# EAGLE design MainBoard (EAGLE 9.2.2)
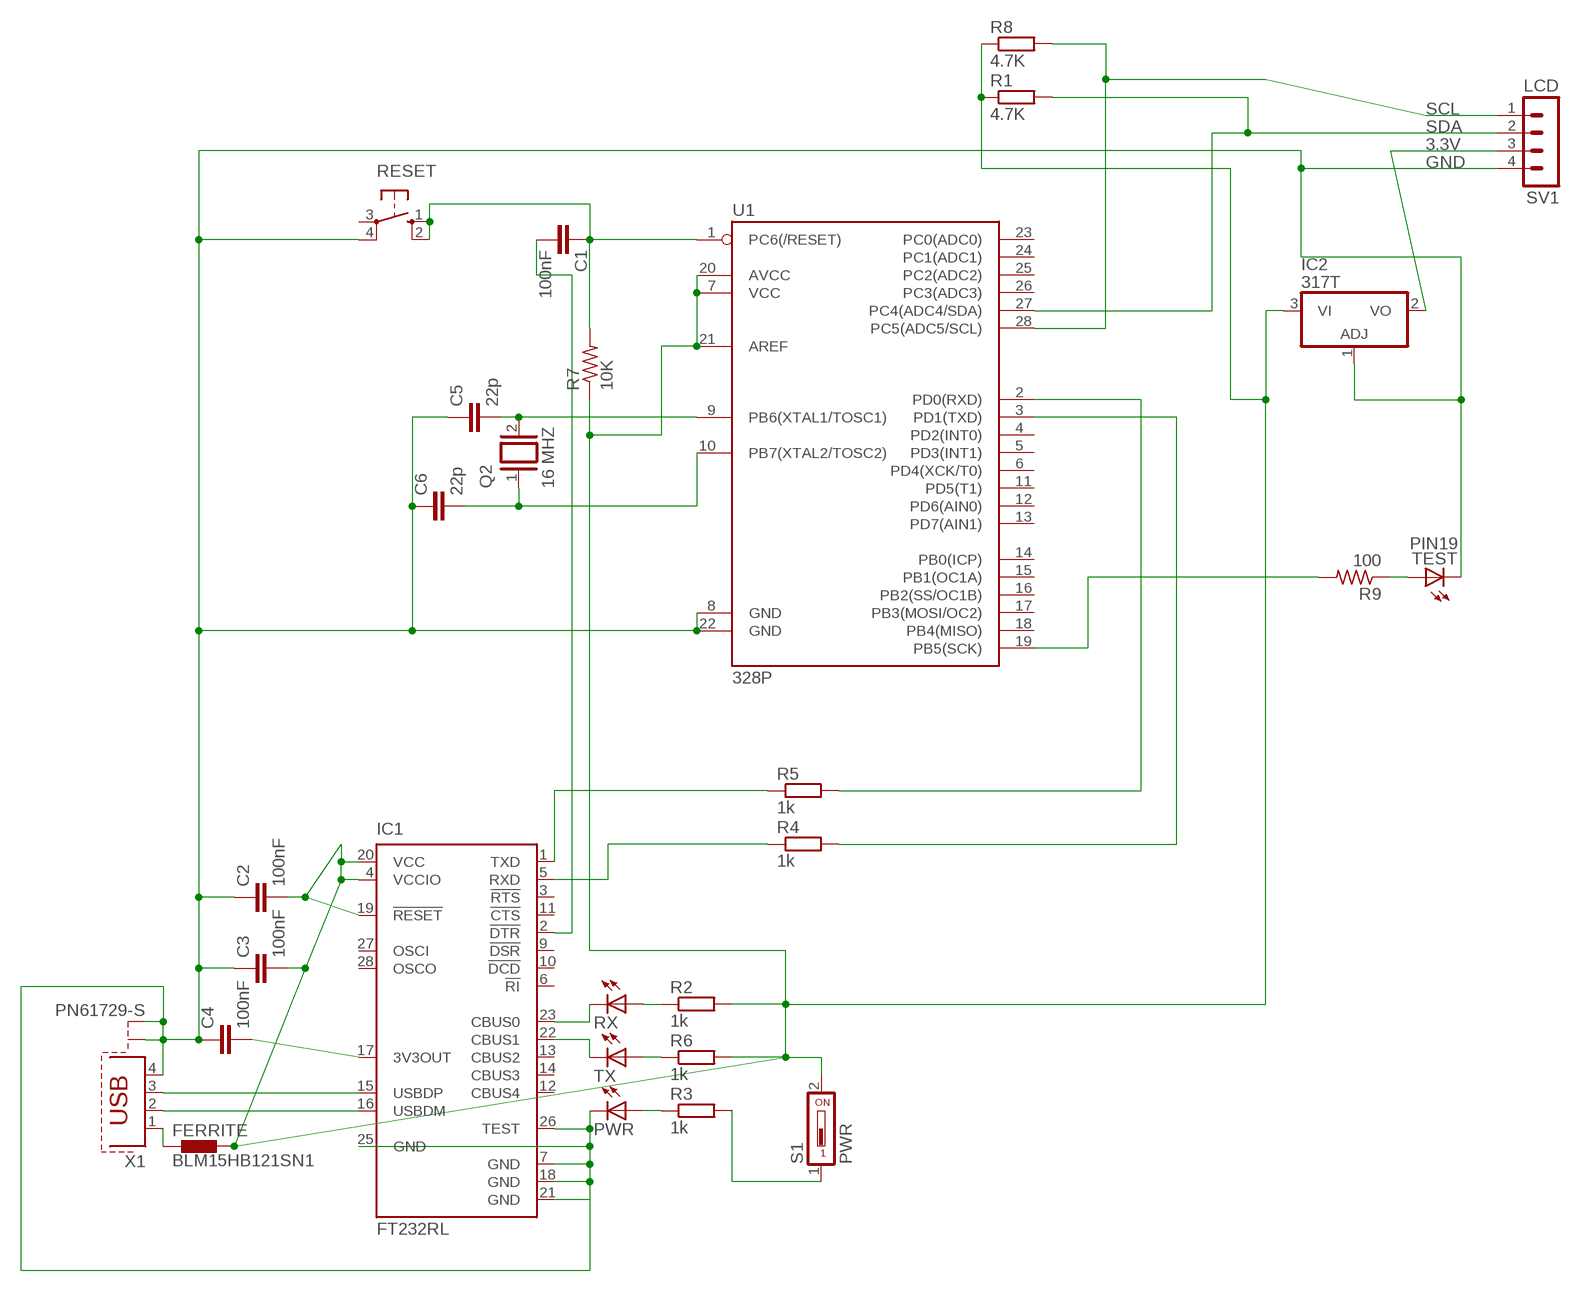
[diagram p0: schematic, sheet 1]

## Parts
C1  100nF  C-EU025-025X050  [C025-025X050]
C2  100nF  C-EU025-025X050  [C025-025X050]
C3  100nF  C-EU025-025X050  [C025-025X050]
C4  100nF  C-EU025-025X050  [C025-025X050]
C5  22p  C-EU025-025X050  [C025-025X050]
C6  22p  C-EU025-025X050  [C025-025X050]
FERRITE  BLM15HB121SN1  [0402]
IC1  FT232RL  [SSOP28]
IC2  317T  [TO220H]
PWR  LED5MM  [LED5MM]
Q2  16 MHZ  XTAL/S  [QS]
R1  4.7K  R-EU_0207/10  [0207/10]
R2  1k  R-EU_0207/10  [0207/10]
R3  1k  R-EU_0207/10  [0207/10]
R4  1k  R-EU_0207/10  [0207/10]
R5  1k  R-EU_0207/10  [0207/10]
R6  1k  R-EU_0207/10  [0207/10]
R7  10K  R-US_0207/10  [0207/10]
R8  4.7K  R-EU_0207/10  [0207/10]
R9  100  R-US_0207/10  [0207/10]
RESET  10-XX  [B3F-10XX]
RX  LED5MM  [LED5MM]
S1  PWR  DS01  [DS-01]
SV1  LCD  MA04-1  [MA04-1]
TEST  PIN19  LED5MM  [LED5MM]
TX  LED5MM  [LED5MM]
U1  328P  ATMEGA328P_PDIP  [DIP28]
X1  PN61729-S  [PN61729-S]

## Nets
3.3V: IC2.2(VO) SV1.3
GND: C2.1 C3.1 C4.1 C5.1 C6.1 IC1.7(GND) IC1.18(GND) IC1.21(GND) IC1.25(GND) IC1.26(TEST) IC2.1(ADJ) PWR.K(C) RESET.4(P1) SV1.4 TEST.K(C) U1.8(GND) U1.22(GND) X1.4 X1.S1 X1.S2
N$1: IC1.1(TXD) R5.1
N$2: IC1.16(USBDM) X1.2
N$3: IC1.15(USBDP) X1.3
N$4: C2.2 C3.2 FERRITE.2 IC1.4(VCCIO) IC1.19(!RESET) IC1.20(VCC) IC2.3(VI) R1.1 R2.2 R6.2 R7.1 R8.1 S1.2 U1.7(VCC) U1.20(AVCC) U1.21(AREF)
N$5: C4.2 IC1.17(3V3OUT)
N$6: FERRITE.1 X1.1
N$7: R9.1 TEST.A
N$8: IC1.5(RXD) R4.1
N$9: R5.2 U1.2(PD0(RXD))
N$10: R4.2 U1.3(PD1(TXD))
N$11: IC1.23(CBUS0) RX.K(C)
N$12: R2.1 RX.A
N$13: IC1.22(CBUS1) TX.K(C)
N$14: R6.1 TX.A
N$15: PWR.A R3.1
N$16: R3.2 S1.1
N$17: C1.2 IC1.2(!DTR)
N$21: R9.2 U1.19(PB5(SCK))
N$23: C5.2 Q2.2 U1.9(PB6(XTAL1/TOSC1))
N$24: C6.2 Q2.1 U1.10(PB7(XTAL2/TOSC2))
PIN1: C1.1 R7.2 RESET.1(S) RESET.2(S1) U1.1(PC6(/RESET))
SCL: R8.2 SV1.1 U1.28(PC5(ADC5/SCL))
SDA: R1.2 SV1.2 U1.27(PC4(ADC4/SDA))
Unconnected: IC1.3(!RTS) IC1.6(!RI) IC1.9(!DSR) IC1.10(!DCD) IC1.11(!CTS) IC1.12(CBUS4) IC1.13(CBUS2) IC1.14(CBUS3) IC1.27(OSCI) IC1.28(OSCO) RESET.3(P) U1.4(PD2(INT0)) U1.5(PD3(INT1)) U1.6(PD4(XCK/T0)) U1.11(PD5(T1)) U1.12(PD6(AIN0)) U1.13(PD7(AIN1)) U1.14(PB0(ICP)) U1.15(PB1(OC1A)) U1.16(PB2(SS/OC1B)) U1.17(PB3(MOSI/OC2)) U1.18(PB4(MISO)) U1.23(PC0(ADC0)) U1.24(PC1(ADC1)) U1.25(PC2(ADC2)) U1.26(PC3(ADC3))

## Library data of the parts
C1-C6 = rcl:C-EU: CAPACITOR, European symbol; SPICEPREFIX: C
FERRITE = inductors:BLM15H: EMIFIL (R) Chip Ferrite Bead for GHz Noise Source: http://www.murata.com/ Ferrite Bead BLM15H.pdf
IC1 = ftdichip:FT232R: Source: http://www.ftdichip.com/Documents/DataSheets/DS_FT232R_v104.pdf; MPN: FT232RL; OC_FARNELL: 1146032; OC_NEWARK: 91K9918
IC2 = linear:*317: Positive VOLTAGE REGULATOR
PWR RX TEST TX = led:LED: LED OSRAM: - CHIPLED LG R971, LG N971, LY N971, LG Q971, LY Q971, LO R971, LY R971 LH N974, LH R974 LS Q976, LO Q976, LY Q976 LO Q996 - Hyper CHIPLED LW Q18S LB Q993, LB Q99A, LB R99A - SideLED LS A670, LO A670, LY A670, LG A670, LP A670 LB A673, LV A673, LT A673, LW A673 LH A674 LY A675 LS A676, LA A676, LO A676, LY A676, LW A676 LS A679, LY A679, LG A679 - Hyper Micro SIDELED® LS Y876, LA Y876, LO Y876, LY Y876 LT Y87S - SmartLED LW L88C, LW L88S LB L89C, LB L89S, LG L890 LS L89K, LO L89K, LY L89K LS L896, LA L896, LO L896, LY L896 - TOPLED LS T670, LO T670, LY T670, LG T670, LP T670 LSG T670, LSP T670, LSY T670, LOP T670, LYG T670 LG T671, LOG T671, LSG T671 LB T673, LV T673, LT T673, LW T673 LH T674 LS T676, LA T676, LO T676, LY T676, LB T676, LH T676, LSB T676, LW T676 LB T67C, LV T67C, LT T67C, LS T67K, LO T67K, LY T67K, LW E67C LS E67B, LA E67B, LO E67B, LY E67B, LB E67C, LV E67C, LT E67C LW T67C LS T679, LY T679, LG T679 LS T770, LO T770, LY T770, LG T770, LP T770 LB T773, LV T773, LT T773, LW T773 LH T774 LS E675, LA E675, LY E675, LS T675 LS T776, LA T776, LO T776, LY T776, LB T776 LHGB T686 LT T68C, LB T68C - Hyper Mini TOPLED® LB M676 - Mini TOPLED Santana® LG M470 LS M47K, LO M47K, LY M47K Source: http://www.osram.convergy.de LUXEON: - LUMILED® LXK2-PW12-R00, LXK2-PW12-S00, LXK2-PW14-U00, LXK2-PW14-V00 LXK2-PM12-R00, LXK2-PM12-S00, LXK2-PM14-U00 LXK2-PE12-Q00, LXK2-PE12-R00, LXK2-PE12-S00, LXK2-PE14-T00, LXK2-PE14-U00 LXK2-PB12-K00, LXK2-PB12-L00, LXK2-PB12-M00, LXK2-PB14-N00, LXK2-PB14-P00, LXK2-PB14-Q00 LXK2-PR12-L00, LXK2-PR12-M00, LXK2-PR14-Q00, LXK2-PR14-R00 LXK2-PD12-Q00, LXK2-PD12-R00, LXK2-PD12-S00 LXK2-PH12-R00, LXK2-PH12-S00 LXK2-PL12-P00, LXK2-PL12-Q00, LXK2-PL12-R00 Source: www.luxeon.com KINGBRIGHT: KA-3528ASYC Source: www.kingbright.com
Q2 = special:XTAL/S: CRYSTAL
R1-R6 R8 = resistor:R-EU_: RESISTOR, European symbol
R7 R9 = resistor:R-US_: RESISTOR, American symbol
RESET = switch-omron:10-XX: OMRON SWITCH; MPN: B3F-1000; OC_FARNELL: 176432; OC_NEWARK: 36M3542
S1 = switch-dil:DS01: DIL/CODE SWITCH; OC_FARNELL: unknown; OC_NEWARK: unknown
SV1 = con-lstb:MA04-1: PIN HEADER; OC_FARNELL: unknown; OC_NEWARK: unknown
U1 = SparkFun-IC-Microcontroller:ATMEGA328P_PDIP: Atmel 328P Through hole ATMEGA328P uC used in the Arduino 32kb flash, 1k EEPROM, 2k SRAM Datasheet <http://www.sparkfun.com/datasheets/Components/SMD/ATMega328.pdf> SparkFun Products Storefront component: AVR 28 Pin 20MHz 32K 6A/D - ATMega328P <https://www.sparkfun.com/products/9061> (COM-09061) SparkFun Simon Says - Through-Hole Soldering Kit <https://www.sparkfun.com/products/10547> (KIT-10547) SparkFun Learn to Solder - Simon Says <https://www.sparkfun.com/products/13708> (KIT-13708) SparkFun BigTime Watch Kit <https://www.sparkfun.com/products/11734> (KIT-11734) SparkFun ClockIt <https://www.sparkfun.com/products/10930> (KIT-10930) SparkFun Serial Enabled LCD Kit <https://www.sparkfun.com/products/10097> (LCD-10097) SparkFun Simon Tilts - Through Hole Soldering Kit <https://www.sparkfun.com/products/12634> (KIT-12634) SparkFun Frequency Counter Kit <https://www.sparkfun.com/products/10140> (KIT-10140) FabFM Radio Kit <https://www.sparkfun.com/products/11043> (KIT-11043) SparkFun Binary Blaster Kit <https://www.sparkfun.com/products/12037> (KIT-12037) SparkFun Metro-Gnome <https://www.sparkfun.com/products/9236> (KIT-09236) ATmega328 with Arduino Optiboot (Uno) <https://www.sparkfun.com/products/10524> (DEV-10524); PROD_ID: IC-09136
X1 = con-berg:PN61729-S: BERG USB connector; OC_FARNELL: unknown; OC_NEWARK: unknown

## Net classes
0 default: width 0.254 mm, drill 0.33 mm, clearance 0.251 mm

## Board
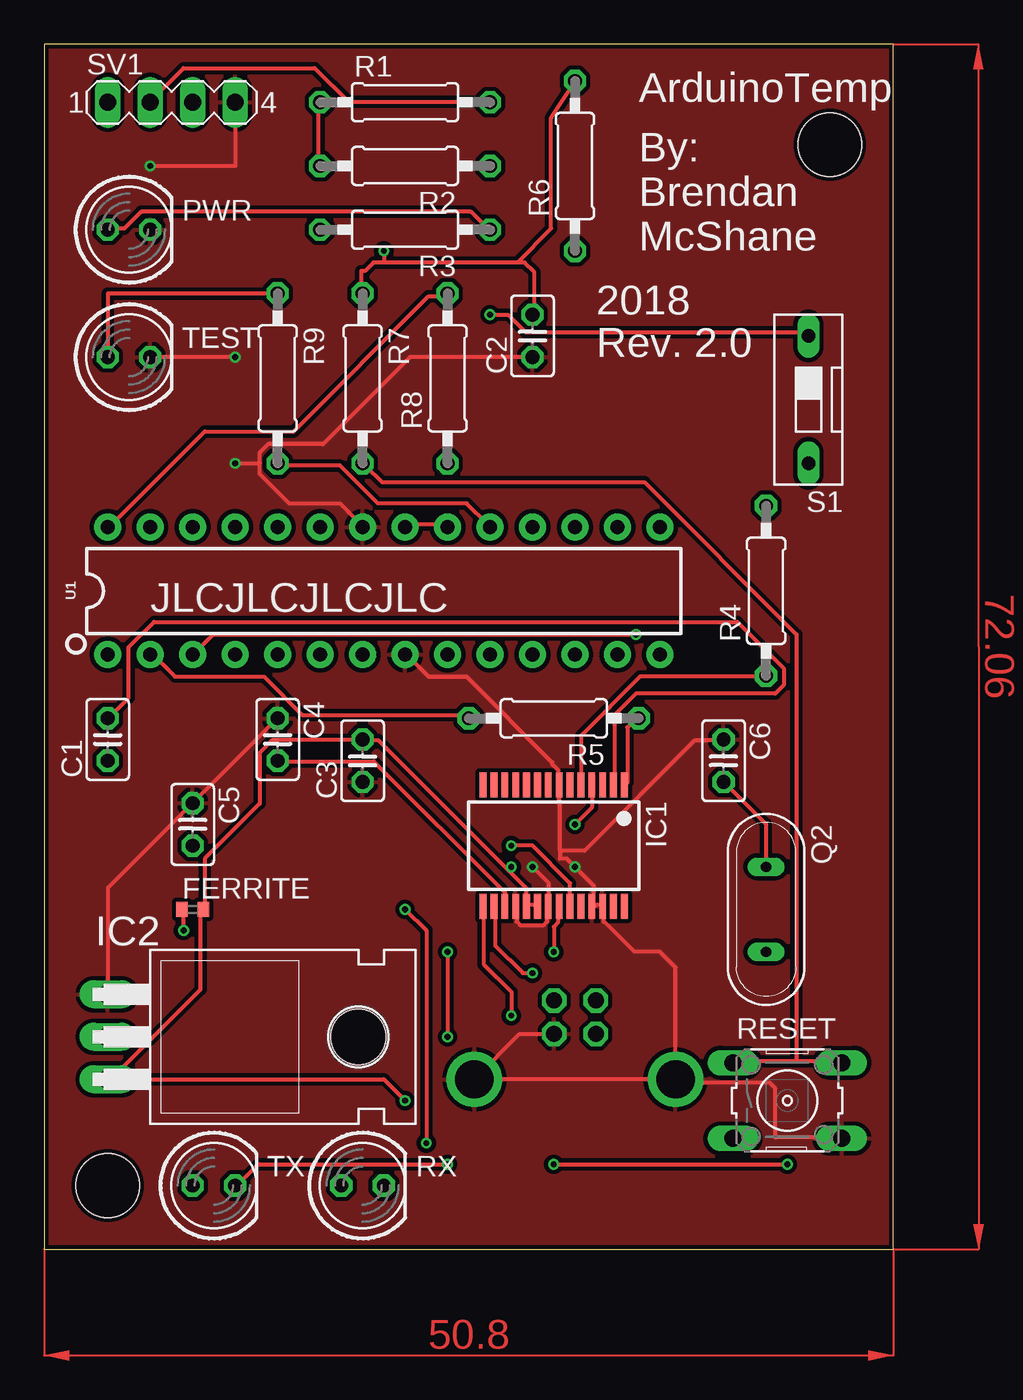
[diagram p1: board, top side]
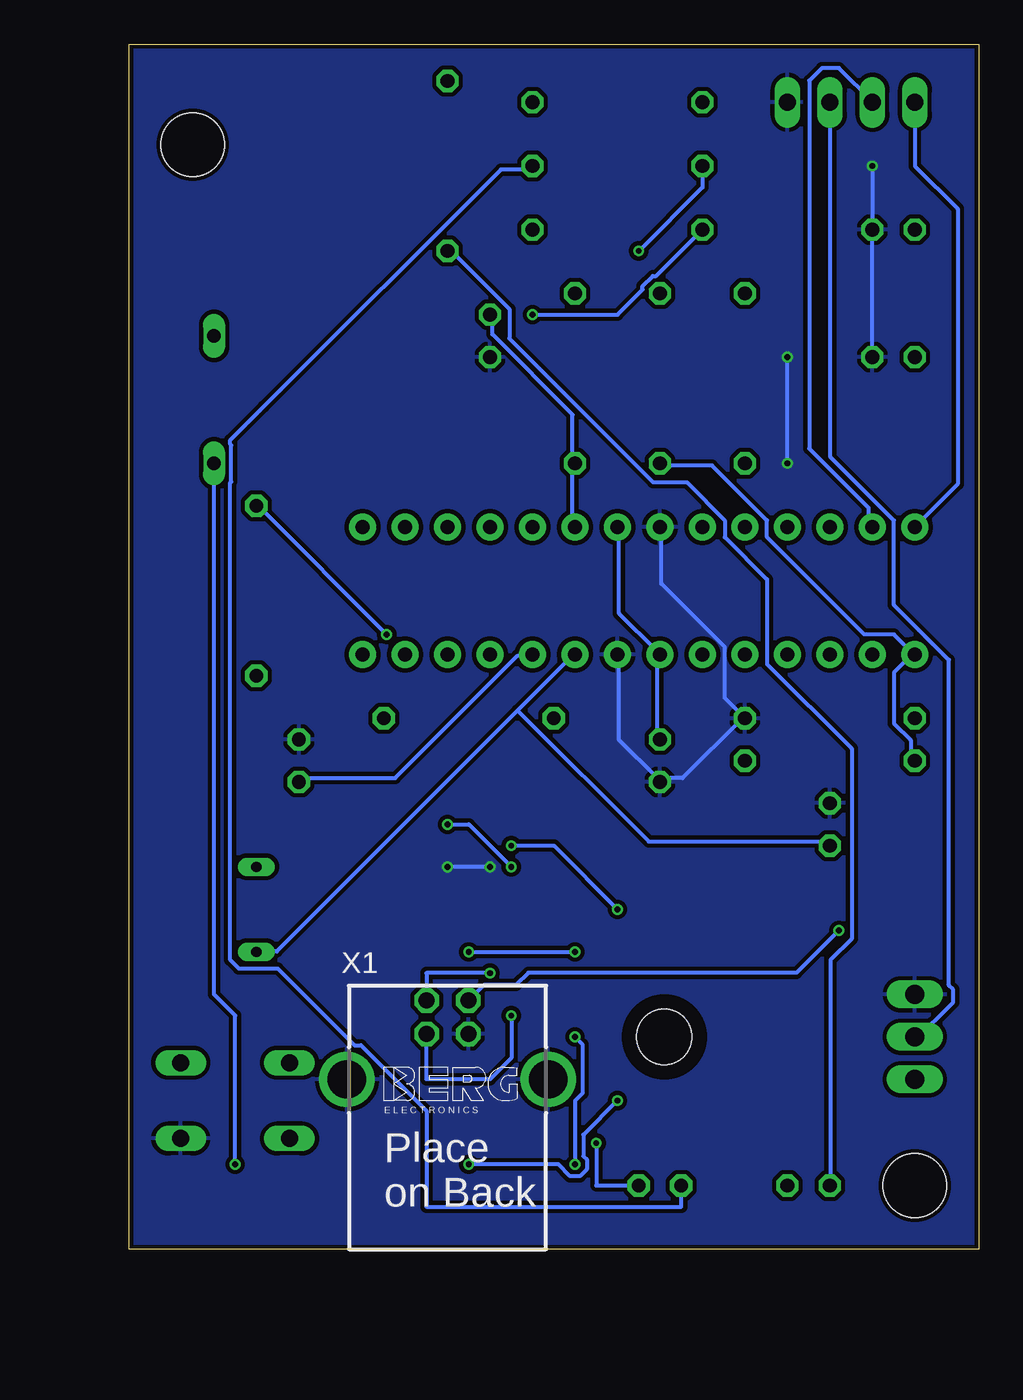
[diagram p2: board, bottom side, seen from below]

Size 50.78 x 72.06 mm. Coordinates in mm from the lower left corner, seen from the top.
Outline: 0,0 50.78,0 50.78,72.06 0,72.06 0,0
Copper layers (1*16): Top 0.035mm / dielectric 1.5mm / Bottom 0.035mm
Design rules "dirt_cheap_dirty_boards.v1.1": minimum track width 6mil, minimum drill 12mil, track to track 6mil, track to pad 6mil, pad to pad 6mil, via to via 6mil, smd to smd 0mil, copper to edge 10mil, drill to drill 10mil, minimum pad ring 10mil, minimum via ring 6mil, stop-mask expansion 2mil, vias tented up to drill 25mil, thermal gap 10mil
Holes 3.81 mm at 46.99,66.04 3.81,3.81

### Footprints (pad centres in the part's own frame; a part is rotated, then mirrored left to right if it is on the bottom)
C025-025X050 = drill 0.813 octagon: 1 -1.27,0; 2 1.27,0
0402 = smd 0.7 x 0.9: 1 -0.65,0; 2 0.65,0
SSOP28 = smd 0.4 x 1.5: 1 -4.225,-3.625; 2 -3.575,-3.625; 3 -2.925,-3.625; 4 -2.275,-3.625; 5 -1.625,-3.625; 6 -0.975,-3.625; 7 -0.325,-3.625; 8 0.325,-3.625; 9 0.975,-3.625; 10 1.625,-3.625; 11 2.275,-3.625; 12 2.925,-3.625; 13 3.575,-3.625; 14 4.225,-3.625; 15 4.225,3.625; 16 3.575,3.625; 17 2.925,3.625; 18 2.275,3.625; 19 1.625,3.625; 20 0.975,3.625; 21 0.325,3.625; 22 -0.325,3.625; 23 -0.975,3.625; 24 -1.625,3.625; 25 -2.275,3.625; 26 -2.925,3.625; 27 -3.575,3.625; 28 -4.225,3.625
TO220H = drill 1.118 long: 1 -2.54,-10.16; 2 0,-10.16; 3 2.54,-10.16 | hole 3.302: 0,4.826
LED5MM = drill 0.813 octagon: A -1.27,0; K 1.27,0
QS = drill 0.61 long: 1 -2.54,0; 2 2.54,0
0207/10 = drill 0.813 octagon: 1 -5.08,0; 2 5.08,0
B3F-10XX = drill 1.016 long: 1 -3.251,2.261; 2 3.251,2.261; 3 -3.251,-2.261; 4 3.251,-2.261
DS-01 = drill 0.813 long: 1 0,-3.81; 2 0,3.81
MA04-1 = drill 1.016 long: 1 -3.81,0; 2 -1.27,0; 3 1.27,0; 4 3.81,0
DIP28 = drill 0.813 pad 1.626: 1 -16.51,-3.81; 2 -13.97,-3.81; 3 -11.43,-3.81; 4 -8.89,-3.81; 5 -6.35,-3.81; 6 -3.81,-3.81; 7 -1.27,-3.81; 8 1.27,-3.81; 9 3.81,-3.81; 10 6.35,-3.81; 11 8.89,-3.81; 12 11.43,-3.81; 13 13.97,-3.81; 14 16.51,-3.81; 15 16.51,3.81; 16 13.97,3.81; 17 11.43,3.81; 18 8.89,3.81; 19 6.35,3.81; 20 3.81,3.81; 21 1.27,3.81; 22 -1.27,3.81; 23 -3.81,3.81; 24 -6.35,3.81; 25 -8.89,3.81; 26 -11.43,3.81; 27 -13.97,3.81; 28 -16.51,3.81
PN61729-S = drill 0.95 octagon: 1 1.25,4.71; 2 -1.25,4.71; 3 -1.25,2.71; 4 1.25,2.71 | drill 2.3 pad 2.9: S1 -6.02,0; S2 6.02,0

### Placement (x,y rotation side)
C1  3.81,30.48 90 top
C2  29.21,54.61 90 top
C3  19.05,29.21 90 top
C4  13.97,30.48 270 top
C5  8.89,25.4 270 top
C6  40.64,29.21 270 top
FERRITE  8.89,20.32 0 top
IC1  30.48,24.13 180 top
IC2  13.97,12.7 270 top
PWR  5.08,60.96 0 top
Q2  43.18,20.32 270 top
R1  21.59,68.58 0 top
R2  21.59,64.77 180 top
R3  21.59,60.96 180 top
R4  43.18,39.37 90 top
R5  30.48,31.75 180 top
R6  31.75,64.77 90 top
R7  19.05,52.07 270 top
R8  24.13,52.07 90 top
R9  13.97,52.07 270 top
RESET  44.45,8.89 0 top
RX  19.05,3.81 0 top
S1  45.72,50.8 180 top
SV1  7.62,68.58 0 top
TEST  5.08,53.34 0 top
TX  10.16,3.81 0 top
U1  20.32,39.37 0 top
X1  31.75,10.16 0 bottom

### Tracks (layer width: path | path; a pad name or v marks a point on that pad's centre or on a via)
3.3V
  Bottom 0.254: SV1.3 8.85,68.35 8.85,47.37 5.06,43.58 5.06,38.53 1.77,35.24 1.77,15.78 1.52,15.53 1.52,14.77 3.8,12.5 IC2.2
GND  (via drill 0.35)
  Top 0.254: 33.02,20.58 33.37,20.58 33.48,20.47 33.48,20.43 | 33.02,20.58 32.86,20.58 32.86,21.75 v31.75,22.86 31.25,23.36 30.84,23.36 30.84,23.86 | 30.84,23.86 30.84,26.67 30.8,26.7 IC1.7 30.73,27.83 30.73,28.66 30.39,29 30.39,29.12 25.28,34.23 23,34.23 21.74,35.5 U1.8 | 30.84,23.86 32.34,23.86 38.93,30.44 40.44,30.44 C6.1 | RESET.4 47.52,6.68 43.73,6.68 43.73,9.61 43.37,9.97 37.96,9.97 X1.S1 | C4.1 13.91,31.7 8.89,26.69 C5.1 3.81,21.59 IC2.1 | 12.89,46.99 12.89,46.36 14.66,44.59 17.7,44.59 18.96,43.33 U1.22 | 12.89,46.99 12.89,47.63 13.4,48.13 16.69,48.13 21.89,53.34 C2.1 | v29.21,22.86 30.16,21.91 IC1.21 30.08,20.43 30.08,19.6 29.86,19.38 28.5,19.38 28.28,19.6 28.28,20.43 IC1.18 | X1.S1 X1.S2 28.44,12.87 X1.4 | X1.S1 37.77,16.84 36.83,17.78 35.3,17.78 33.48,19.6 33.48,20.43 | 12.89,46.99 v11.43,46.99 | v11.43,53.34 TEST.K | SV1.4 11.43,64.77 v6.35,64.77 | IC1.26 33.48,20.43 | 33.02,20.58 32.94,20.5 IC1.25
  Bottom 0.254: U1.22 18.96,43.08 18.96,39.79 15.17,36 15.17,32.97 14.16,31.96 C4.1 14.16,31.7 17.7,28.17 18.96,28.17 C3.1 19.21,28.17 21.49,30.44 21.49,35.5 U1.8 | v29.21,22.86 v31.75,22.86 | v11.43,46.99 v11.43,53.34 | TEST.K PWR.K v6.35,64.77
  pour Top: 0,72.39 50.8,72.39 50.8,0 0,0
  pour Bottom: 0,72.39 50.8,72.39 50.8,0 0,0
N$1
  Top 0.254: IC1.1 34.88,27.91 34.88,31.2 35.39,31.7 R5.1
N$2  (via drill 0.35)
  Top 0.254: IC1.16 26.98,20.43 26.98,18.16 28.63,16.51 v29.21,16.51
  Bottom 0.254: v29.21,16.51 33.02,16.51 33,16.49 X1.2
N$3  (via drill 0.35)
  Top 0.254: IC1.15 26.29,20.33 26.29,17.05 27.94,15.4 v27.94,13.97
  Bottom 0.254: v27.94,13.97 27.94,11.43 29.21,10.16 33.02,10.16 33.02,12.85 X1.3
N$4  (via drill 0.35)
  Top 0.254: R7.1 18.96,57.23 18.96,58.49 19.2,58.49 19.7,59 20.32,59 | R1.1 16.43,68.35 16.43,64.81 R2.2 | 28.31,59 30.33,61.02 30.33,67.64 R6.2 | C2.2 29.32,55.97 29.32,58.42 28.74,59 28.31,59 | U1.21 21.74,43.33 24.02,43.33 U1.20 | 28.31,59 20.32,59 | 28.82,20.58 29.32,20.58 IC1.20 | 28.82,20.58 28.82,21.59 27.75,22.67 | 27.75,22.67 19.97,30.44 19.21,30.44 C3.2 18.96,30.44 13.65,30.44 12.89,29.68 12.89,26.65 9.61,23.36 9.61,20.33 FERRITE.2 9.36,20.08 9.36,15.53 4.05,10.22 IC2.3 20.32,10.16 v21.59,8.89 | 28.82,20.58 IC1.19 | IC1.4 32.76,26.4 v31.75,25.4 | v27.94,22.86 | v27.94,22.86 27.75,22.67 | v30.48,5.08 v44.45,5.08 | v20.32,59.69 20.32,59
  Bottom 0.254: U1.20 24.27,43.33 24.27,46.87 R8.1 24.27,47.12 24.27,49.9 29.07,54.7 29.07,55.71 C2.2 | C3.2 19.21,30.69 19.21,35.5 U1.7 19.21,35.75 21.49,38.02 21.49,43.08 U1.21 | v31.75,25.4 30.48,25.4 v27.94,22.86 | v21.59,8.89 23.62,6.86 23.62,5.57 23.42,5.37 23.42,4.79 23.84,4.37 24.42,4.37 25.13,5.08 v30.48,5.08 | v44.45,5.08 44.45,13.97 45.72,15.24 S1.2 | R2.2 16.51,63.5 v20.32,59.69
N$5
  Top 0.254: IC1.17 27.55,20.58 27.55,21.34 19.72,29.18 14.16,29.18 C4.2
N$6  (via drill 0.35)
  Top 0.254: v8.35,19.07 8.35,20.08 FERRITE.1
  Bottom 0.254: v8.35,19.07 10.89,16.53 26.92,16.53 27.65,15.8 29.57,15.8 X1.1
N$7
  Top 0.254: R9.1 3.81,57.15 TEST.A
N$8
  Top 0.254: IC1.5 32.1,27.91 32.1,30.69 35.64,34.23 42.97,34.23 R4.1
N$9
  Top 0.254: R5.2 25.28,31.96 15.42,31.96 13.15,34.23 7.84,34.23 6.58,35.5 U1.2
N$10  (via drill 0.35)
  Top 0.254: v35.39,36.76 10.12,36.76 9.11,35.75 U1.3
  Bottom 0.254: v35.39,36.76 42.97,44.34 R4.2
N$11  (via drill 0.35)
  Top 0.254: IC1.23 31.45,21.89 29.21,24.13 v27.94,24.13 | v21.59,20.32 22.86,19.05 v22.86,6.35
  Bottom 0.254: v27.94,24.13 25.4,24.13 v21.59,20.32 | v22.86,6.35 22.86,3.81 RX.K
N$12
  Bottom 0.254: R2.1 26.8,64.56 28.57,64.56 42.75,50.37 44.74,48.38 44.74,48.14 44.68,48.08 44.68,45.9 44.74,45.84 44.74,17.3 44.23,16.79 41.91,16.79 37.31,12.2 36.93,12.2 33.02,8.29 33.02,2.54 17.78,2.54 RX.A
N$13  (via drill 0.35)
  Top 0.254: TX.K 11.63,3.9 12.81,5.08 v24.13,5.08 | IC1.22 30.73,20.43 30.73,19.53 30.48,19.28 v30.48,17.78 | v24.13,17.78 v24.13,12.7
  Bottom 0.254: v30.48,17.78 v24.13,17.78 | v24.13,5.08 24.13,8.88 23.69,9.32 23.69,12.26 v24.13,12.7
N$14
  Bottom 0.254: TX.A 8.85,3.9 8.85,17.3 7.59,18.56 7.59,29.93 12.64,34.99 12.64,40.04 15.17,42.57 15.17,43.58 17.45,45.86 19.47,45.86 28.06,54.45 28.06,56.22 31.6,59.76 R6.1
N$15
  Top 0.254: PWR.A 4.05,61.02 4.81,61.02 5.82,62.03 25.53,62.03 26.54,61.02 R3.1
N$16  (via drill 0.35)
  Top 0.254: v26.67,55.88 27.74,55.88 28.78,54.84 45.49,54.84 S1.1
  Bottom 0.254: v26.67,55.88 21.59,55.88 20.09,57.38 20.09,57.58 19.48,58.19 19.28,58.19 R3.2
N$17
  Top 0.254: IC1.2 34.12,27.91 34.12,31.96 35.39,33.22 43.73,33.22 44.23,33.73 44.23,34.74 41.45,37.52 6.58,37.52 5.06,36 5.06,32.97 4.05,31.96 C1.2
N$21
  Top 0.254: R9.2 14.16,46.87 17.7,46.87 19.97,44.59 25.28,44.59 26.54,43.33 U1.19
N$23
  Bottom 0.254: 27.55,32.21 24.27,35.5 U1.9 | 27.55,32.21 41.96,17.8 43.16,17.8 Q2.2 | 27.55,32.21 19.72,24.37 9.11,24.37 C5.2
N$24
  Top 0.254: C6.2 40.7,27.91 43.18,25.43 Q2.1
  Bottom 0.254: U1.10 26.8,35.5 27.55,35.5 34.88,28.17 40.44,28.17 C6.2
PIN1
  Top 0.254: 44.99,11.23 47.52,11.23 RESET.2 | 44.99,11.23 41.2,11.23 RESET.1 | 44.99,11.23 44.99,36.76 35.89,45.86 20.22,45.86 19.21,46.87 R7.2
  Bottom 0.254: C1.1 4.05,29.43 4.05,30.44 5.06,31.45 5.06,34.48 4.05,35.5 U1.1 4.05,35.75 5.06,36.76 6.83,36.76 12.64,42.57 12.64,43.58 15.93,46.87 18.96,46.87 R7.2
SCL
  Top 0.254: R8.2 24.02,56.98 23,56.98 14.92,48.89 9.61,48.89 4.05,43.33 U1.28
  Bottom 0.254: U1.28 1.25,45.74 1.25,62.21 3.81,64.77 SV1.1
SDA
  Top 0.254: R1.2 26.54,68.6 18.2,68.6 16.18,70.62 8.35,70.62 6.32,68.6 SV1.2
  Bottom 0.254: U1.27 6.58,43.33 6.58,44.34 10.12,47.88 10.12,69.87 9.36,70.62 8.35,70.62 6.32,68.6 SV1.2
(copper drawn outside any net)
  shapes: Top area x2

### Text on the board
tPlace: ArduinoTemp | By: / Brendan / McShane | 2018 | Rev. 2.0 | JLCJLCJLCJLC
bPlace: Place / on Back